# Altium schematic sheet HARDCAL1_REVA_PG1.SchDoc: MODEL: HC 15C
size 863 x 558 mm; DocumentNumber: HC 15C; SheetNumber: 1; SheetTotal: 3; Title2: HAB'S 1ST GEN CALCULATOR
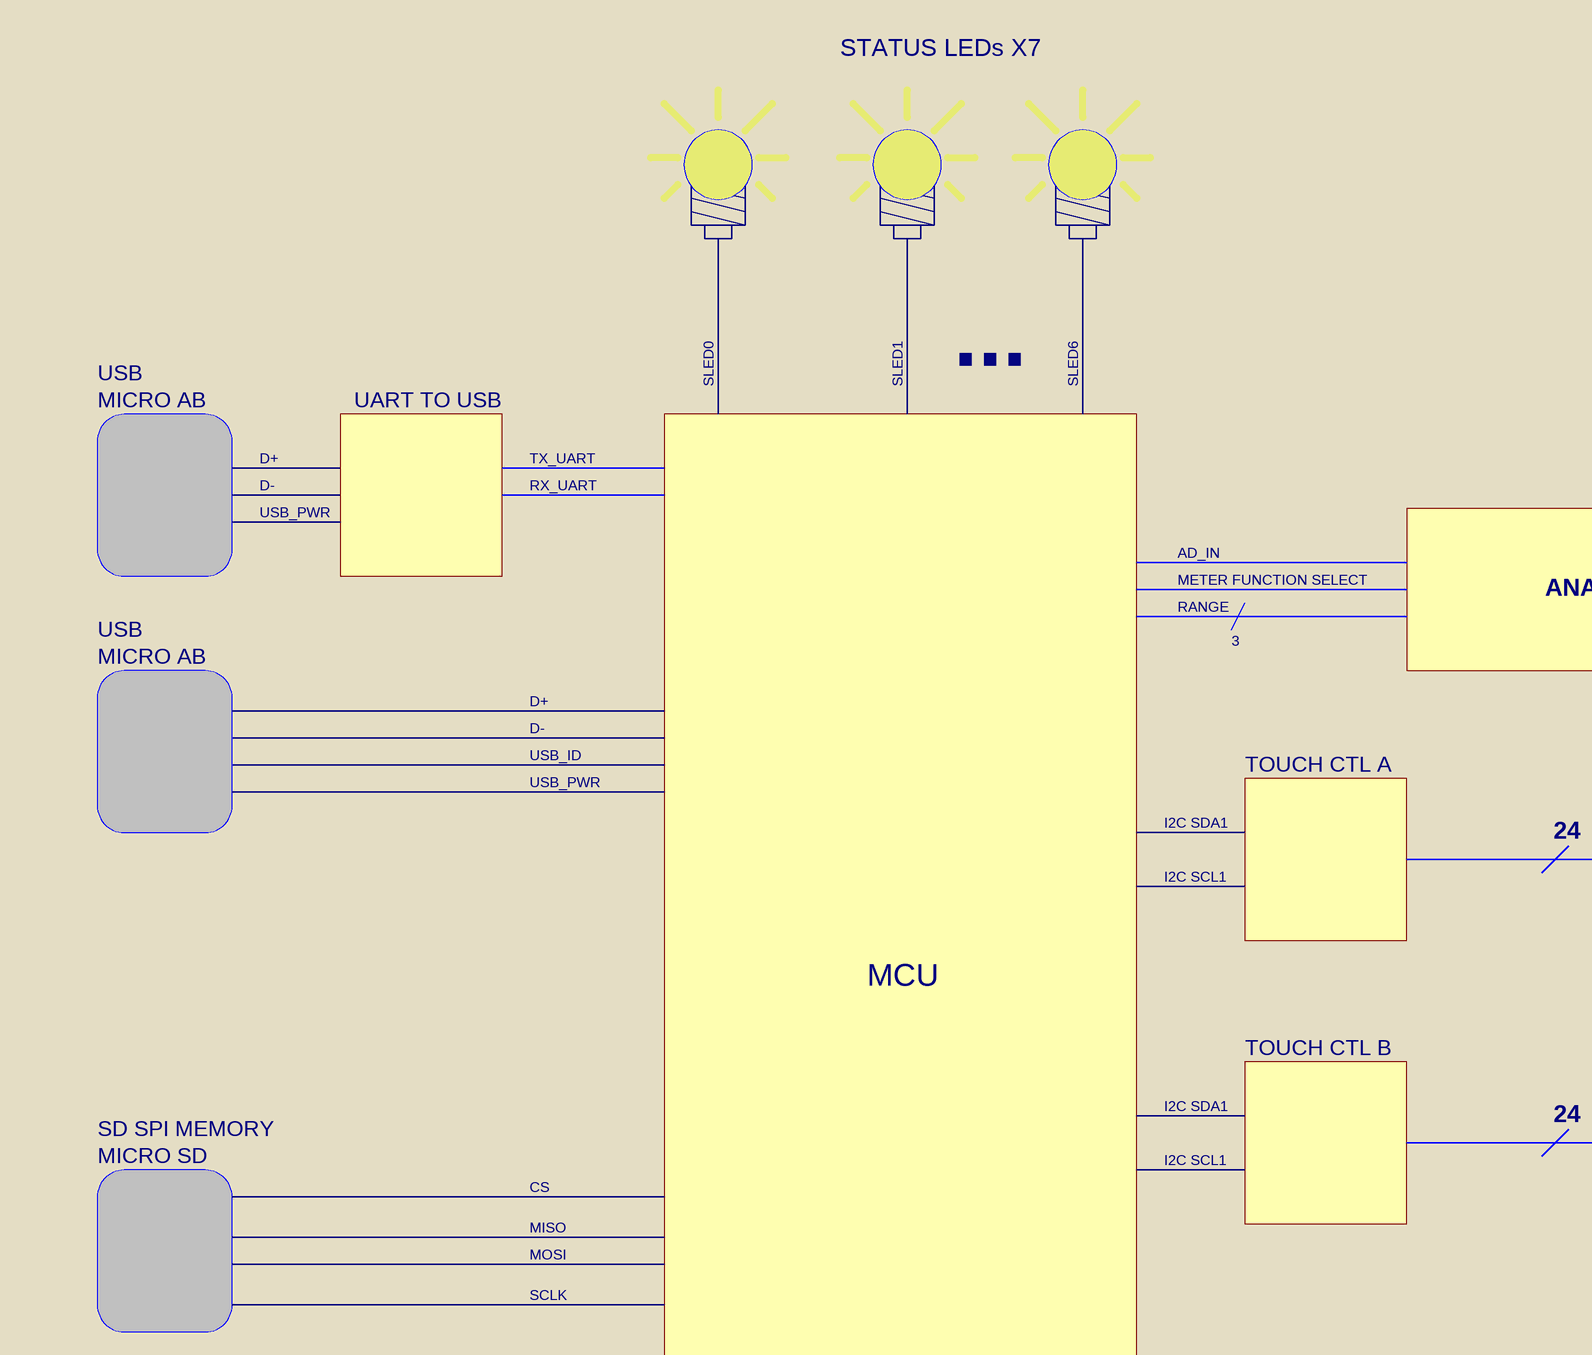
[diagram p0: HARDCAL1_REVA_PG1.SchDoc, top left]
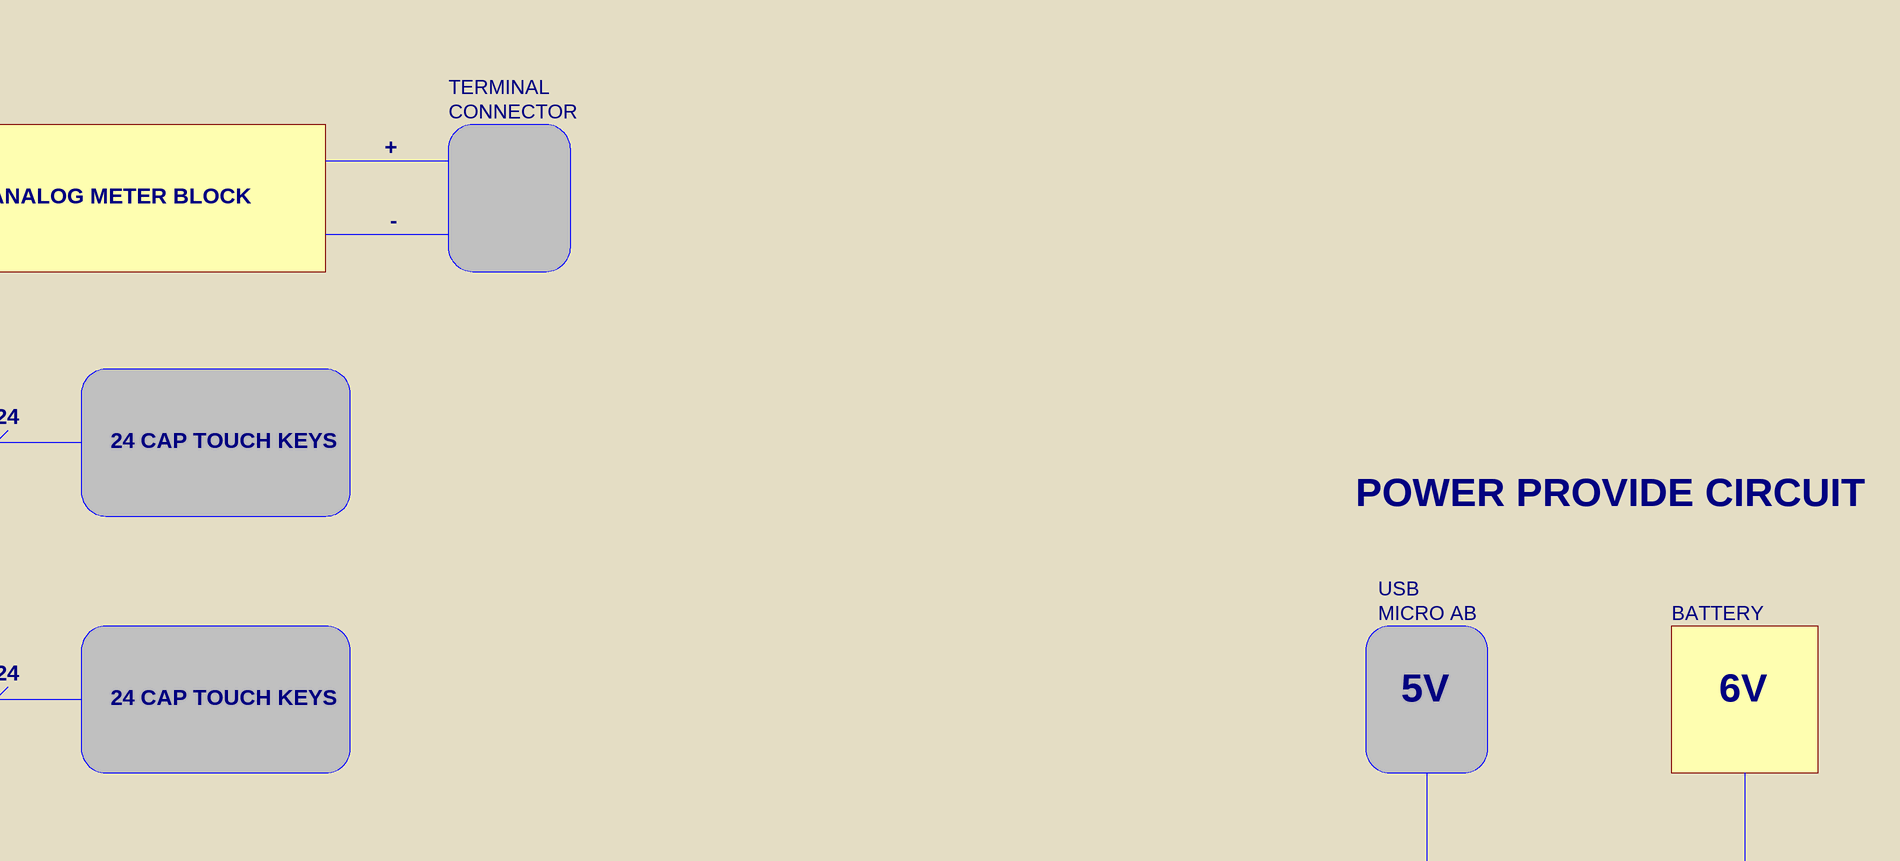
[diagram p1: HARDCAL1_REVA_PG1.SchDoc, top right]
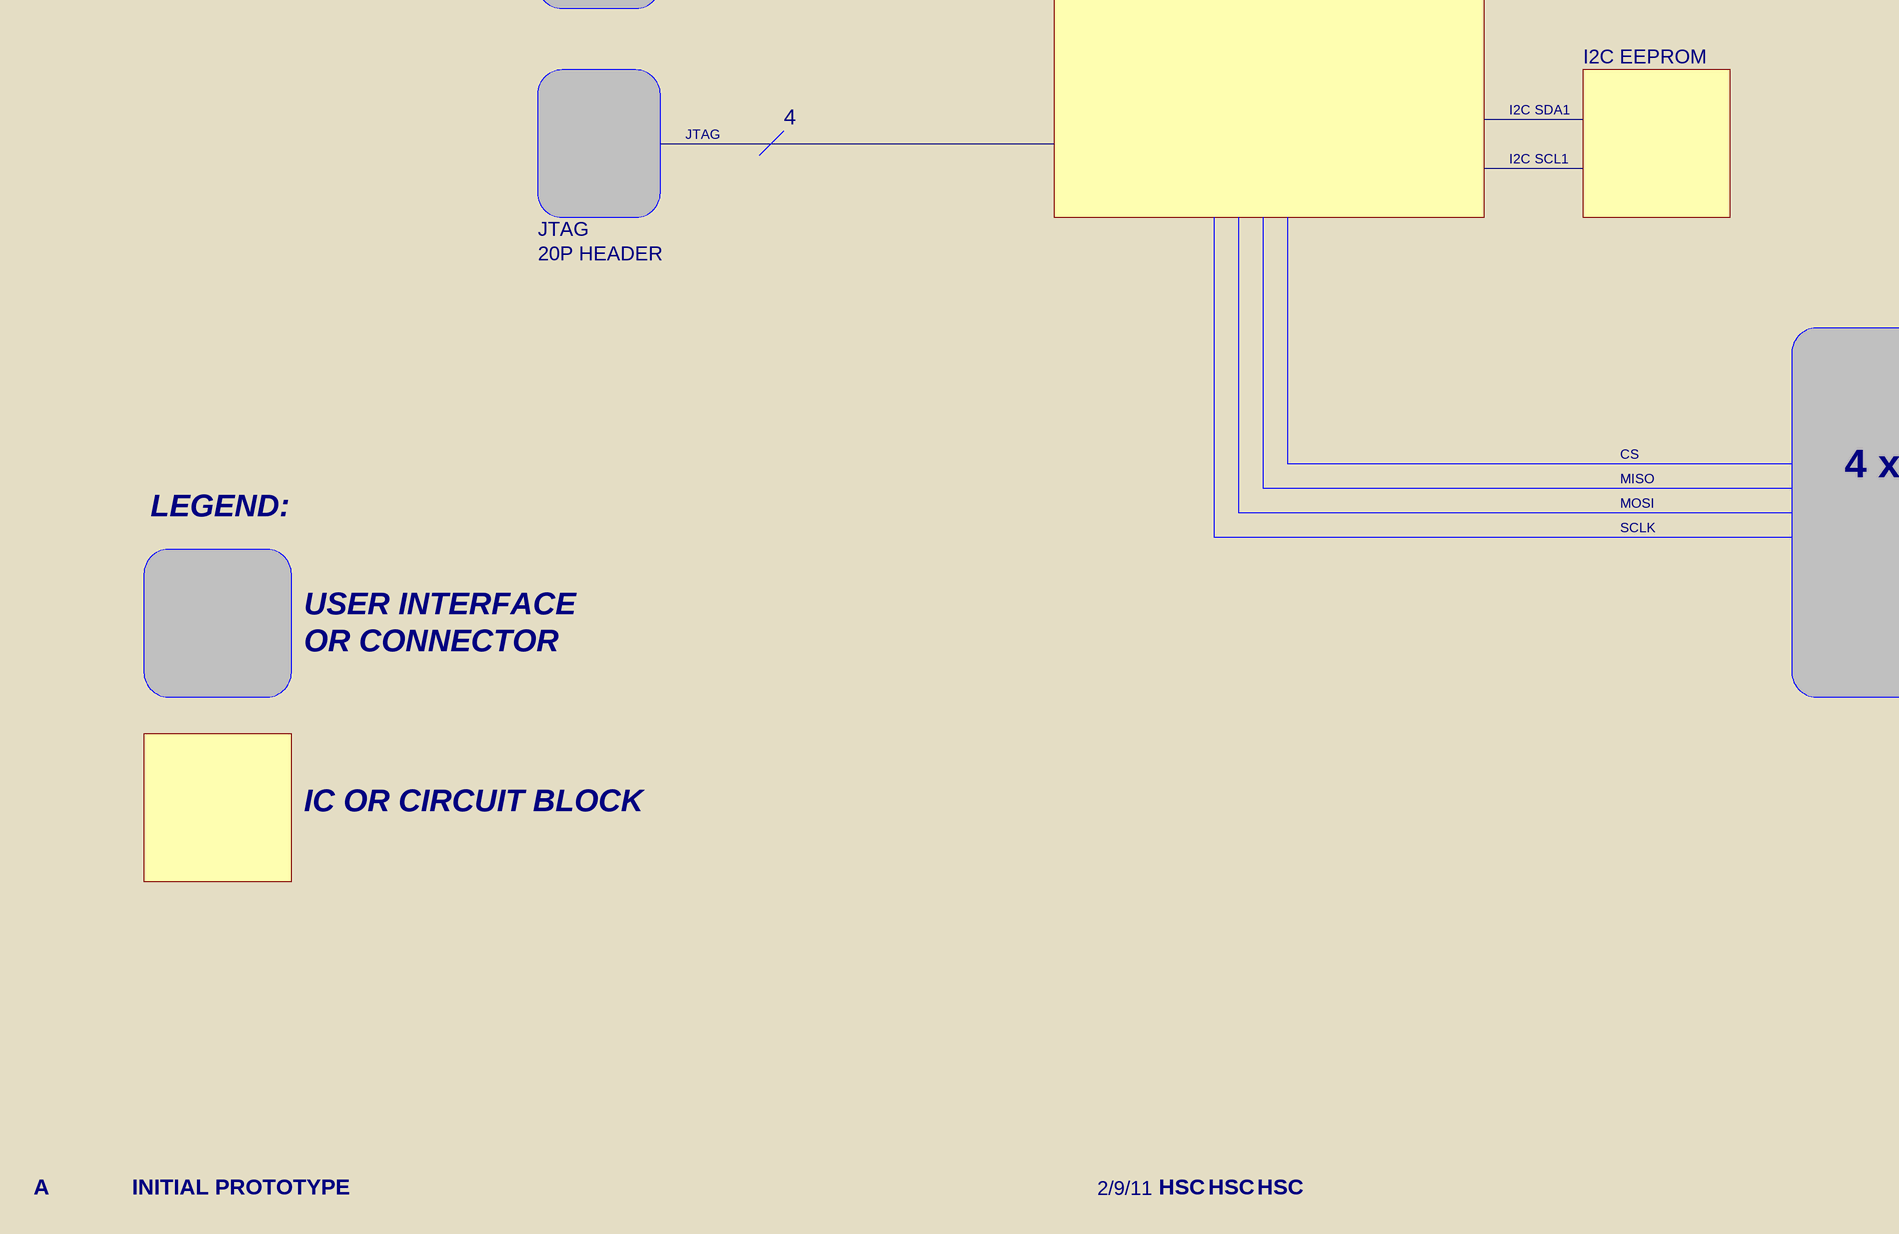
[diagram p2: HARDCAL1_REVA_PG1.SchDoc, bottom left]
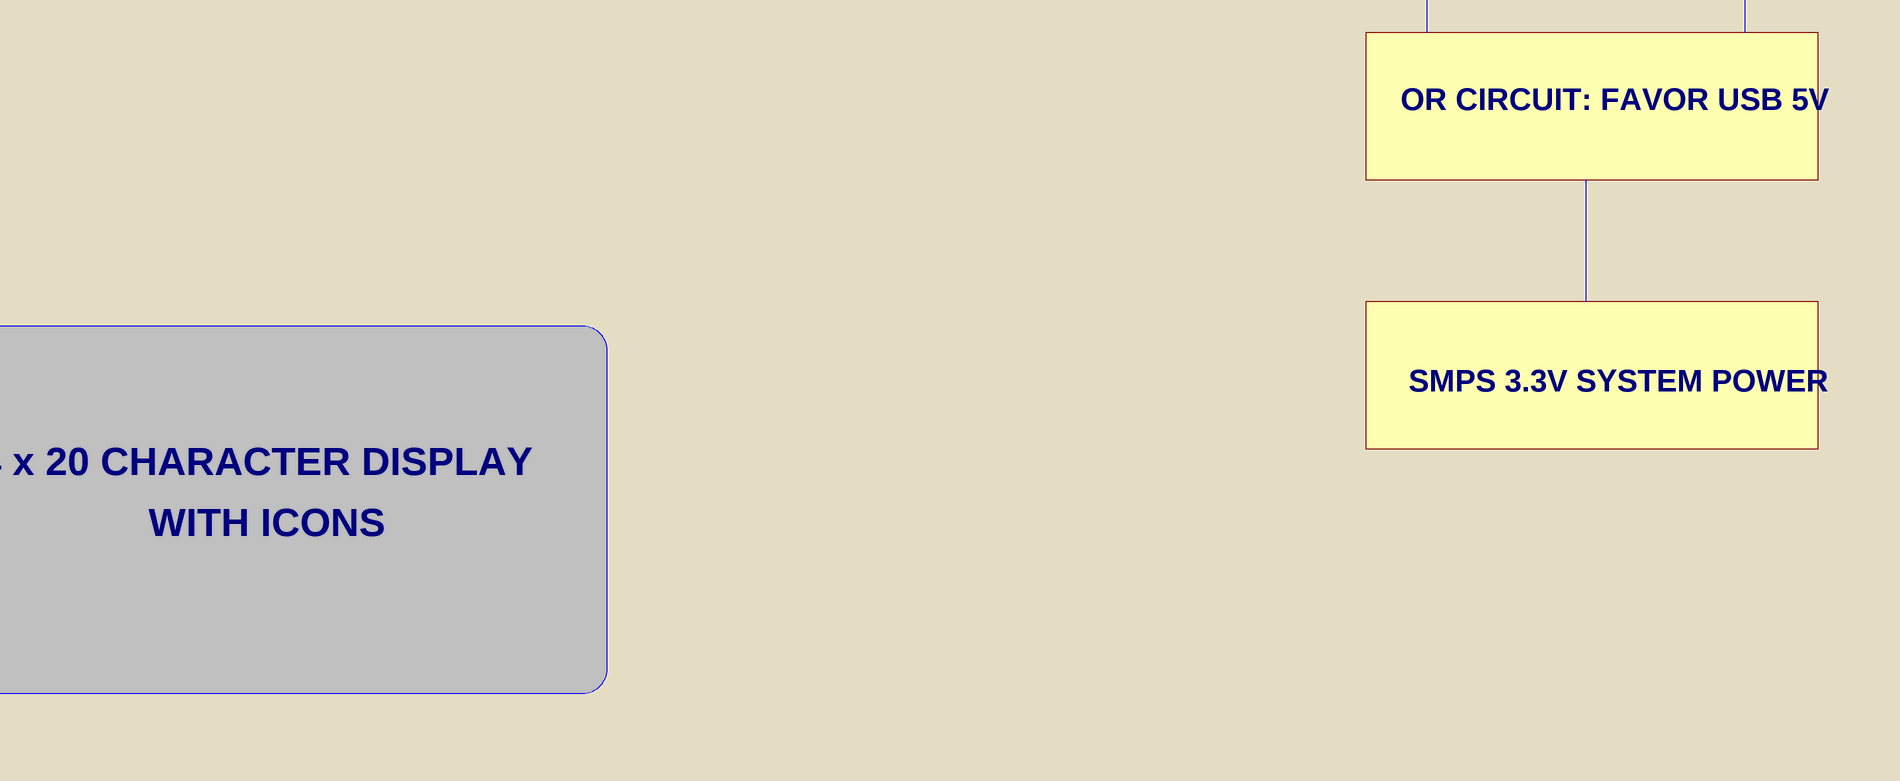
[diagram p3: HARDCAL1_REVA_PG1.SchDoc, bottom right]

## Notes on the sheet
- STATUS LEDs X7
- MICRO AB
- USB
- UART TO USB
- SLED0
- SLED1
- ...
- SLED6
- D+
- D-
- TX_UART
- RX_UART
- TERMINAL
- USB_PWR
- AD_IN
- +
- CONNECTOR
- METER FUNCTION SELECT
- RANGE
- ANALOG METER BLOCK
- -
- 3
- USB_ID
- I2C SDA1
- TOUCH CTL A
- I2C SCL1
- 24
- 24 CAP TOUCH KEYS
- POWER PROVIDE CIRCUIT
- MCU
- TOUCH CTL B
- BATTERY
- SD SPI MEMORY
- MICRO SD
- 5V
- 6V
- MISO
- CS
- MOSI
- SCLK
- I2C EEPROM
- JTAG
- 4
- OR CIRCUIT: FAVOR USB 5V
- 20P HEADER
- SMPS 3.3V SYSTEM POWER
- LEGEND:
- 4 x 20 CHARACTER DISPLAY
- WITH ICONS
- USER INTERFACE
- OR CONNECTOR
- IC OR CIRCUIT BLOCK
- A
- INITIAL PROTOTYPE
- 2/9/11
- HSC
- TITLE:
- SHEET:
- OF
- SCHEMATIC
- DRAWING #:
- 3621 GIN WAY
- CONYERS, GA 30039
- INFORMATION CONTAINED HEREIN IS THE PROPERTY OF Hab Collector
- DBA HabWorks AND IS TO BE HELD IN COMPLETE CONFIDENCE.
- PHONE: 678-687-0270
- FILENAME:
- FILETYPE:
- REV
- ECO#
- DESCRIPTION
- DATE
- DRW
- CHK
- APR
- REPRODUCE WITH WRITTEN CONSENT ONLY.
- ALTIUM